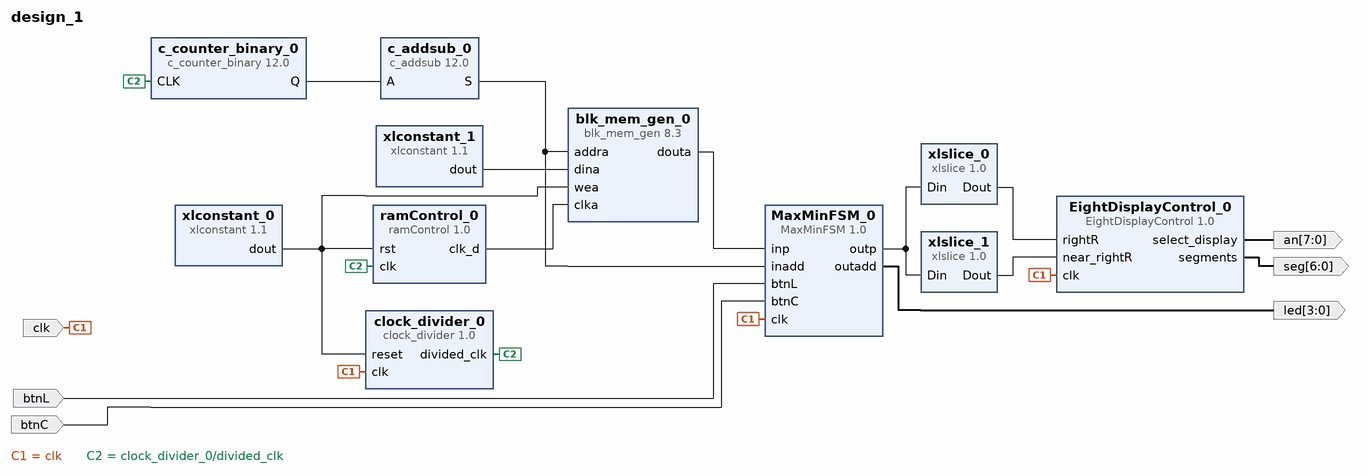
[diagram p0: block diagram of the top level]
# Vivado block design design_1, xc7a100tcsg324-1, Vivado 2016.4
create_bd_design design_1

create_bd_port -dir I -type clk clk
set_property -dict {CONFIG.FREQ_HZ 100000000} [get_bd_ports clk]
create_bd_port -dir O -from 7 -to 0 an
create_bd_port -dir O -from 6 -to 0 seg
create_bd_port -dir O -from 3 -to 0 led
create_bd_port -dir I -type rst btnL
set_property -dict {CONFIG.POLARITY ACTIVE_HIGH} [get_bd_ports btnL]
create_bd_port -dir I -type rst btnC
set_property -dict {CONFIG.POLARITY ACTIVE_HIGH} [get_bd_ports btnC]

create_bd_cell -type ip -vlnv xilinx.com:ip:blk_mem_gen:8.3 blk_mem_gen_0
set_property -dict [list \
  CONFIG.Enable_32bit_Address false \
  CONFIG.Use_Byte_Write_Enable false \
  CONFIG.Write_Width_A 8 \
  CONFIG.Read_Width_A 8 \
  CONFIG.Enable_A Always_Enabled \
  CONFIG.Register_PortA_Output_of_Memory_Primitives false \
  CONFIG.Register_PortA_Output_of_Memory_Core true \
  CONFIG.Load_Init_File true \
  CONFIG.Coe_File ../../../../../../../../Aula3/Aula3_estudo_ex4/coe/aula6_ex1.coe \
  CONFIG.Use_RSTA_Pin false \
  CONFIG.use_bram_block Stand_Alone \
] [get_bd_cells blk_mem_gen_0]
create_bd_cell -type ip -vlnv xilinx.com:user:clock_divider:1.0 clock_divider_0
set_property -dict {CONFIG.how_fast 26} [get_bd_cells clock_divider_0]
create_bd_cell -type ip -vlnv xilinx.com:user:ramControl:1.0 ramControl_0
create_bd_cell -type ip -vlnv xilinx.com:ip:c_addsub:12.0 c_addsub_0
set_property -dict [list \
  CONFIG.A_Type Unsigned \
  CONFIG.B_Type Unsigned \
  CONFIG.A_Width 4 \
  CONFIG.B_Width 4 \
  CONFIG.Add_Mode Subtract \
  CONFIG.Out_Width 4 \
  CONFIG.Latency 0 \
  CONFIG.B_Constant true \
  CONFIG.B_Value 0001 \
  CONFIG.CE false \
] [get_bd_cells c_addsub_0]
create_bd_cell -type ip -vlnv xilinx.com:user:EightDisplayControl:1.0 EightDisplayControl_0
create_bd_cell -type ip -vlnv xilinx.com:ip:xlconstant:1.1 xlconstant_0
set_property -dict {CONFIG.CONST_VAL 0} [get_bd_cells xlconstant_0]
create_bd_cell -type ip -vlnv xilinx.com:ip:xlslice:1.0 xlslice_0
set_property -dict {CONFIG.DOUT_WIDTH 4 CONFIG.DIN_TO 0 CONFIG.DIN_FROM 3 CONFIG.DIN_WIDTH 8} [get_bd_cells xlslice_0]
create_bd_cell -type ip -vlnv xilinx.com:ip:xlslice:1.0 xlslice_1
set_property -dict {CONFIG.DOUT_WIDTH 4 CONFIG.DIN_TO 4 CONFIG.DIN_FROM 7 CONFIG.DIN_WIDTH 8} [get_bd_cells xlslice_1]
create_bd_cell -type ip -vlnv xilinx.com:ip:c_counter_binary:12.0 c_counter_binary_0
set_property -dict {CONFIG.Output_Width 4} [get_bd_cells c_counter_binary_0]
create_bd_cell -type ip -vlnv xilinx.com:user:MaxMinFSM:1.0 MaxMinFSM_0
create_bd_cell -type ip -vlnv xilinx.com:ip:xlconstant:1.1 xlconstant_1
set_property -dict {CONFIG.CONST_WIDTH 8 CONFIG.CONST_VAL 0} [get_bd_cells xlconstant_1]

# ---- connections ----

connect_bd_net [get_bd_pins xlconstant_0/dout] [get_bd_pins clock_divider_0/reset] [get_bd_pins ramControl_0/rst] [get_bd_pins blk_mem_gen_0/wea]
connect_bd_net [get_bd_ports clk] [get_bd_pins clock_divider_0/clk] [get_bd_pins EightDisplayControl_0/clk] [get_bd_pins MaxMinFSM_0/clk]
connect_bd_net [get_bd_pins c_addsub_0/S] [get_bd_pins blk_mem_gen_0/addra] [get_bd_pins MaxMinFSM_0/inadd]
connect_bd_net [get_bd_pins ramControl_0/clk_d] [get_bd_pins blk_mem_gen_0/clka]
connect_bd_net [get_bd_pins EightDisplayControl_0/select_display] [get_bd_ports an]
connect_bd_net [get_bd_pins EightDisplayControl_0/segments] [get_bd_ports seg]
connect_bd_net [get_bd_pins xlslice_0/Dout] [get_bd_pins EightDisplayControl_0/rightR]
connect_bd_net [get_bd_pins xlslice_1/Dout] [get_bd_pins EightDisplayControl_0/near_rightR]
connect_bd_net [get_bd_pins clock_divider_0/divided_clk] [get_bd_pins ramControl_0/clk] [get_bd_pins c_counter_binary_0/CLK]
connect_bd_net [get_bd_pins c_counter_binary_0/Q] [get_bd_pins c_addsub_0/A]
connect_bd_net [get_bd_pins MaxMinFSM_0/outp] [get_bd_pins xlslice_1/Din] [get_bd_pins xlslice_0/Din]
connect_bd_net [get_bd_pins blk_mem_gen_0/douta] [get_bd_pins MaxMinFSM_0/inp]
connect_bd_net [get_bd_pins MaxMinFSM_0/outadd] [get_bd_ports led]
connect_bd_net [get_bd_ports btnL] [get_bd_pins MaxMinFSM_0/btnL]
connect_bd_net [get_bd_ports btnC] [get_bd_pins MaxMinFSM_0/btnC]
connect_bd_net [get_bd_pins xlconstant_1/dout] [get_bd_pins blk_mem_gen_0/dina]

validate_bd_design
save_bd_design
